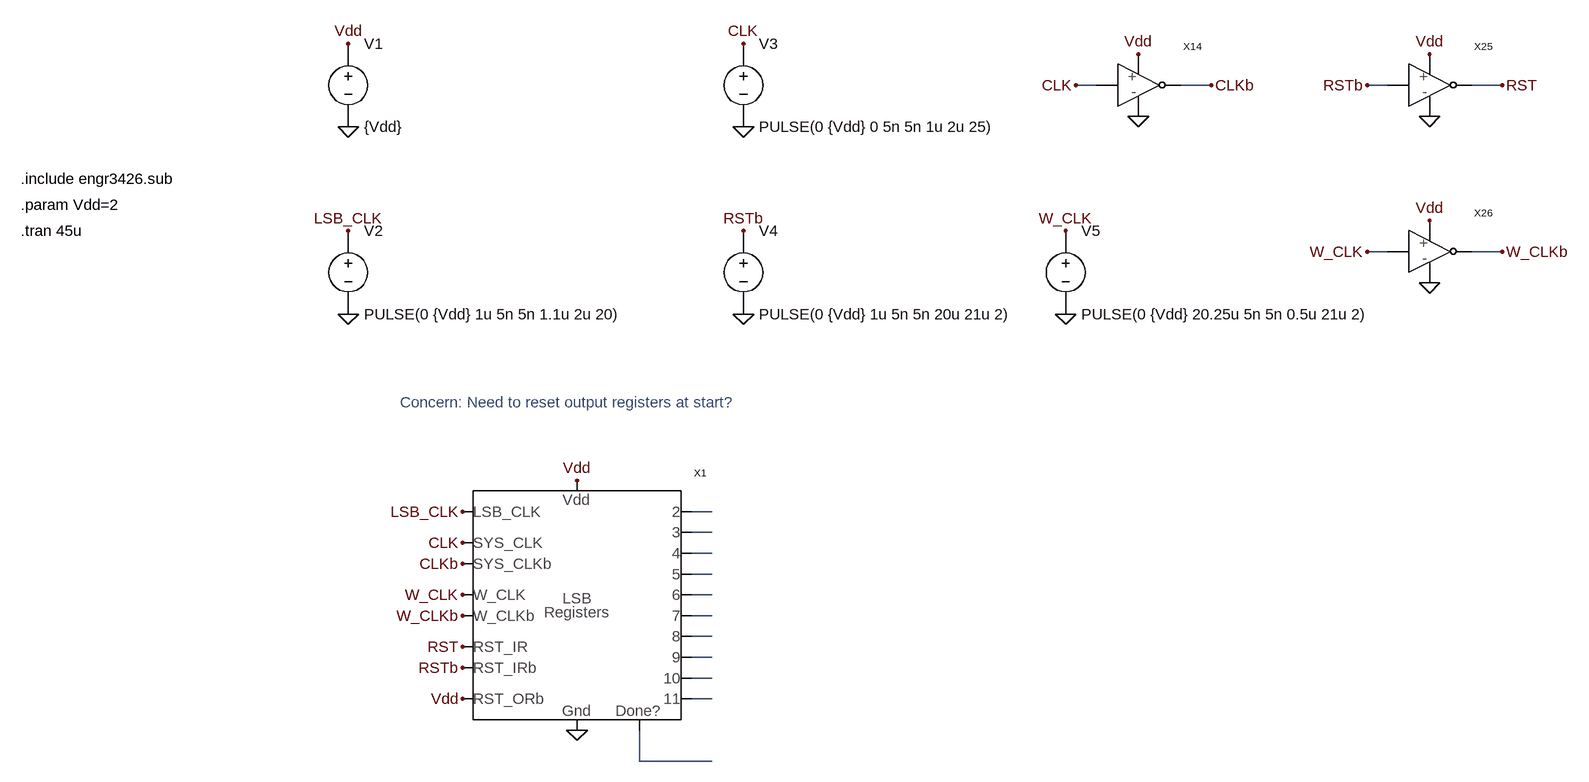
[diagram p0: schematic lsb_registers_test.asc]
lsb_registers_test.asc, the LTspice schematic file:
Version 4
SHEET 1 2676 1412
WIRE -176 -384 -208 -384
WIRE 0 -384 -48 -384
WIRE 272 -384 240 -384
WIRE 448 -384 400 -384
WIRE 272 -128 240 -128
WIRE 448 -128 400 -128
WIRE -768 272 -800 272
WIRE -768 304 -800 304
WIRE -768 336 -800 336
WIRE -768 368 -800 368
WIRE -768 400 -800 400
WIRE -768 432 -800 432
WIRE -768 464 -800 464
WIRE -768 496 -800 496
WIRE -768 528 -800 528
WIRE -768 560 -800 560
WIRE -880 656 -880 608
WIRE -768 656 -880 656
FLAG -1328 -320 0
FLAG -1328 -448 Vdd
FLAG -1328 -160 LSB_CLK
FLAG -1152 272 LSB_CLK
FLAG -720 -320 0
FLAG -720 -448 CLK
FLAG -112 -336 0
FLAG -112 -432 Vdd
FLAG -208 -384 CLK
FLAG 0 -384 CLKb
FLAG -720 -160 RSTb
FLAG -1152 512 RSTb
FLAG -224 -160 W_CLK
FLAG 336 -80 0
FLAG 336 -176 Vdd
FLAG 240 -128 W_CLK
FLAG 448 -128 W_CLKb
FLAG -1152 400 W_CLK
FLAG -1152 432 W_CLKb
FLAG -1152 480 RST
FLAG 336 -336 0
FLAG 336 -432 Vdd
FLAG 240 -384 RSTb
FLAG 448 -384 RST
FLAG -976 224 Vdd
FLAG -1328 -32 0
FLAG -720 -32 0
FLAG -224 -32 0
FLAG -976 608 0
FLAG -1152 320 CLK
FLAG -1152 352 CLKb
FLAG -1152 560 Vdd
SYMBOL cktsym\\vsource -1328 -384 R0
WINDOW 123 0 0 Left 2
WINDOW 39 0 0 Left 2
SYMATTR Value {Vdd}
SYMATTR InstName V1
SYMBOL cktsym\\vsource -1328 -96 R0
WINDOW 123 0 0 Left 2
WINDOW 39 0 0 Left 2
SYMATTR Value PULSE(0 {Vdd} 1u 5n 5n 1.1u 2u 20)
SYMATTR InstName V2
SYMBOL cktsym\\vsource -720 -384 R0
WINDOW 123 0 0 Left 2
WINDOW 39 0 0 Left 2
SYMATTR Value PULSE(0 {Vdd} 0 5n 5n 1u 2u 25)
SYMATTR InstName V3
SYMBOL Inverter -112 -384 R0
SYMATTR InstName X14
SYMATTR SpiceLine nmosL=0.9u nmosW=12u pmosL=0.9u pmosW=24u
SYMBOL cktsym\\vsource -720 -96 R0
WINDOW 123 0 0 Left 2
WINDOW 39 0 0 Left 2
SYMATTR Value PULSE(0 {Vdd} 1u 5n 5n 20u 21u 2)
SYMATTR InstName V4
SYMBOL cktsym\\vsource -224 -96 R0
WINDOW 123 0 0 Left 2
WINDOW 39 0 0 Left 2
SYMATTR Value PULSE(0 {Vdd} 20.25u 5n 5n 0.5u 21u 2)
SYMATTR InstName V5
SYMBOL Inverter 336 -128 R0
SYMATTR InstName X26
SYMATTR SpiceLine nmosL=0.9u nmosW=12u pmosL=0.9u pmosW=24u
SYMBOL Inverter 336 -384 R0
SYMATTR InstName X25
SYMATTR SpiceLine nmosL=0.9u nmosW=12u pmosL=0.9u pmosW=24u
SYMBOL lsb_registers -976 416 R0
SYMATTR InstName X1
TEXT -1832 -240 Left 2 !.include engr3426.sub
TEXT -1832 -200 Left 2 !.param Vdd=2
TEXT -1832 -160 Left 2 !.tran 45u
TEXT -1248 104 Left 2 ;Concern: Need to reset output registers at start?

The netlist it stands for:
* lsb_registers_test.asc
V1 Vdd 0 {Vdd}
V2 LSB_CLK 0 PULSE(0 {Vdd} 1u 5n 5n 1.1u 2u 20)
V3 CLK 0 PULSE(0 {Vdd} 0 5n 5n 1u 2u 25)
XX14 CLK CLKb Vdd 0 Inverter nmosL=0.9u nmosW=12u pmosL=0.9u pmosW=24u  ; pins IN OUT pos neg
V4 RSTb 0 PULSE(0 {Vdd} 1u 5n 5n 20u 21u 2)
V5 W_CLK 0 PULSE(0 {Vdd} 20.25u 5n 5n 0.5u 21u 2)
XX26 W_CLK W_CLKb Vdd 0 Inverter nmosL=0.9u nmosW=12u pmosL=0.9u pmosW=24u  ; pins IN OUT pos neg
XX25 RSTb RST Vdd 0 Inverter nmosL=0.9u nmosW=12u pmosL=0.9u pmosW=24u  ; pins IN OUT pos neg
XX1 LSB_CLK CLK CLKb W_CLK W_CLKb RST RSTb Vdd Vdd 0 N001 N002 N003 N004 N005 N006 N007 N008 N009 N010 N011 lsb_registers  ; pins LSB_CLK SYS_CLK SYS_CLKb W_CLK W_CLKb RST_IR RST_IRb RST_ORb pos neg Bit2 Bit3 Bit4 Bit5 Bit6 Bit7 Bit8 Bit9 Bit10 Bit11 Done?
.include engr3426.sub
.param Vdd=2
.tran 45u
* Concern: Need to reset output registers at start?
.backanno
.end